# EAGLE schematic rx5808 vTup 0.4 (EAGLE 7.4.0)
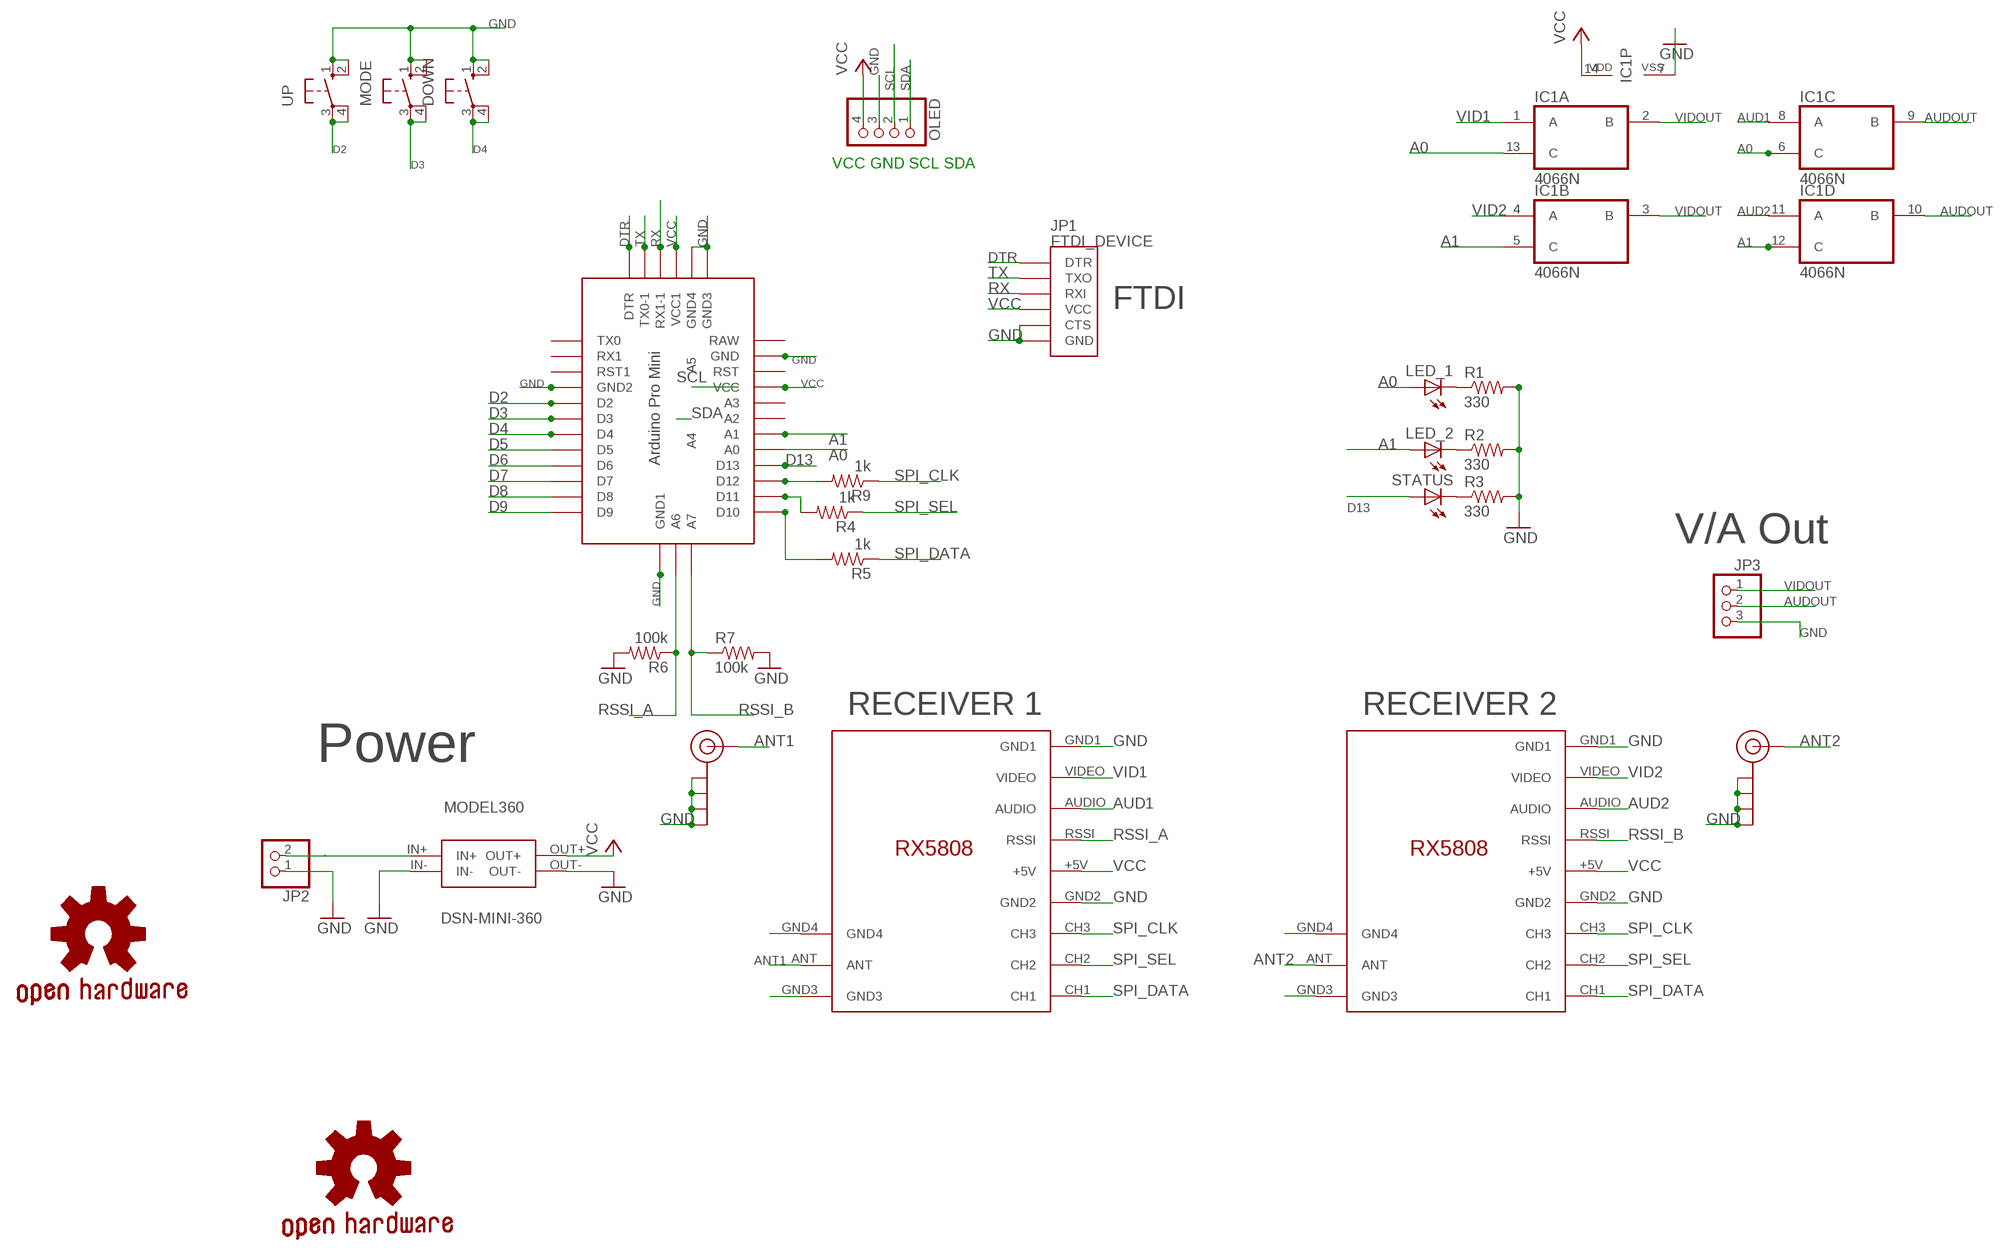
[diagram p0: schematic, sheet 1]

## Parts
ANT1  SMA_EDGE  [SMA-EDGE]
ANT2  SMA_EDGE  [SMA-EDGE]
DOWN  10-XX  [B3F-10XX]
DSN-MINI-360  MODEL360  [MODEL360]
GOLD_ORB_SM1  OSHWLOGO_GOLD_ORB_LG  [OSHW0]
GOLD_ORB_SM2  OSHWLOGO_GOLD_ORB_SM  [OSHW2]
IC1  4066N  [DIL14]
JP1  FTDI_DEVICE  [FTDI_DEVICE_SIDE]
JP2  PINHD-1X2  [1X02]
JP3  PINHD-1X3  [1X03]
LED_1  LED5MM  [LED5MM]
LED_2  LED5MM  [LED5MM]
MODE  10-XX  [B3F-10XX]
OLED  PINHD-1X4  [1X04]
R1  330  R-US_0207/7  [0207/7]
R2  330  R-US_0207/7  [0207/7]
R3  330  R-US_0207/7  [0207/7]
R4  1k  R-US_0207/7  [0207/7]
R5  1k  R-US_0207/7  [0207/7]
R6  100k  R-US_0207/7  [0207/7]
R7  100k  R-US_0207/7  [0207/7]
R9  1k  R-US_0207/7  [0207/7]
RECEIVER_A  RX5808_A  RX5808  [RX5808]
RECEIVER_B  RX5808_B  RX5808  [RX5808]
STATUS  LED5MM  [LED5MM]
U$1  Pro Mini  ABK-PRO-MINI  [ABK-PRO-MINI]
UP  10-XX  [B3F-10XX]

## Nets
A0: IC1.6(C:C) IC1.13(A:C) LED_1.A U$1.A0
A1: IC1.5(B:C) IC1.12(D:C) LED_2.A U$1.A1
ANT1: ANT1.SIG(SIGNAL) RECEIVER_A.ANT
ANT2: ANT2.SIG(SIGNAL) RECEIVER_B.ANT
AUD1: IC1.8(C:A) RECEIVER_A.AUDIO
AUD2: IC1.11(D:A) RECEIVER_B.AUDIO
AUDOUT: IC1.9(C:B) IC1.10(D:B) JP3.2
D2: U$1.D2 UP.3(P) UP.4(P1)
D3: MODE.3(P) MODE.4(P1) U$1.D3
D4: DOWN.3(P) DOWN.4(P1) U$1.D4
D10: R5.2 U$1.D10
D11: R4.2 U$1.D11
D12: R9.2 U$1.D12
D13: STATUS.A U$1.D13
DTR: JP1.P$1(DTR) U$1.GND2(DTR)
GND: ANT1.GND@0(GND) ANT1.GND@1(GND) ANT1.GND@2(GND) ANT1.GND@3(GND) ANT2.GND@0(GND) ANT2.GND@1(GND) ANT2.GND@2(GND) ANT2.GND@3(GND) DOWN.1(S) DOWN.2(S1) DSN-MINI-360.IN- DSN-MINI-360.OUT- IC1.7(P:VSS) JP1.P$5(CTS) JP1.P$6(GND) JP2.1 JP3.3 MODE.1(S) MODE.2(S1) OLED.3 R1.2 R2.2 R3.2 R6.2 R7.2 RECEIVER_A.GND1 RECEIVER_A.GND2 RECEIVER_A.GND3 RECEIVER_A.GND4 RECEIVER_B.GND1 RECEIVER_B.GND2 RECEIVER_B.GND3 RECEIVER_B.GND4 U$1.DTR(GND3) U$1.GND U$1.GND1(GND2) U$1.GND4(GND1) U$1.TX0-1(GND4) UP.1(S) UP.2(S1)
N$1: LED_1.K(C) R1.1
N$2: LED_2.K(C) R2.1
N$3: R3.1 STATUS.K(C)
N$5: DSN-MINI-360.IN+ JP2.2
RSSI_A: R6.1 RECEIVER_A.RSSI U$1.A6
RSSI_B: R7.1 RECEIVER_B.RSSI U$1.A7
RX: JP1.P$3(RXI) U$1.VCC1(RX1-1)
SCL: OLED.2 U$1.A5
SDA: OLED.1 U$1.A4
SPI_CLK: R9.1 RECEIVER_A.CH3 RECEIVER_B.CH3
SPI_DATA: R5.1 RECEIVER_A.CH1 RECEIVER_B.CH1
SPI_SEL: R4.1 RECEIVER_A.CH2 RECEIVER_B.CH2
TX: JP1.P$2(TXO) U$1.GND3(TX0-1)
VCC: DSN-MINI-360.OUT+ IC1.14(P:VDD) JP1.P$4(VCC) OLED.4 RECEIVER_A.+5V RECEIVER_B.+5V U$1.RX1-1(VCC1) U$1.VCC
VID1: IC1.1(A:A) RECEIVER_A.VIDEO
VID2: IC1.4(B:A) RECEIVER_B.VIDEO
VIDOUT: IC1.2(A:B) IC1.3(B:B) JP3.1
Unconnected: U$1.A2 U$1.A3 U$1.D5 U$1.D6 U$1.D7 U$1.D8 U$1.D9 U$1.RAW U$1.RST U$1.RST1 U$1.RX1 U$1.TX0

## Notes on the sheet
- VCC GND SCL SDA
- FTDI
- V/A Out
- RECEIVER 1 | RECEIVER 2
- Power

## Library data of the parts
ANT1 ANT2 = SparkFun-Connectors:SMA_EDGE: SMA Antenna Connector End launch SMA connector. The paste layer has been removed so that the connector can be hand soldered onto the board after reflow.
DOWN MODE UP = switch-omron:10-XX: OMRON SWITCH; MPN: B3F-1000; OC_FARNELL: 176432; OC_NEWARK: 36M3542
DSN-MINI-360 = Model-360-Step-Down:MODEL360
GOLD_ORB_SM1 GOLD_ORB_SM2 = open-source:OSHWLOGO: These are Open-Source Hardware logos.
IC1 = 40xx:4066: Quad bilateral ANALOG SWITCH
JP1 = SparkFun-Connectors:FTDI_DEVICE: Connector which mates to FTDI basic or FTDI cable.
JP2 = pinhead:PINHD-1X2: PIN HEADER
JP3 = pinhead:PINHD-1X3: PIN HEADER
LED_1 LED_2 STATUS = led:LED: LED OSRAM: - CHIPLED LG R971, LG N971, LY N971, LG Q971, LY Q971, LO R971, LY R971 LH N974, LH R974 LS Q976, LO Q976, LY Q976 LO Q996 - Hyper CHIPLED LW Q18S LB Q993, LB Q99A, LB R99A - SideLED LS A670, LO A670, LY A670, LG A670, LP A670 LB A673, LV A673, LT A673, LW A673 LH A674 LY A675 LS A676, LA A676, LO A676, LY A676, LW A676 LS A679, LY A679, LG A679 - Hyper Micro SIDELED® LS Y876, LA Y876, LO Y876, LY Y876 LT Y87S - SmartLED LW L88C, LW L88S LB L89C, LB L89S, LG L890 LS L89K, LO L89K, LY L89K LS L896, LA L896, LO L896, LY L896 - TOPLED LS T670, LO T670, LY T670, LG T670, LP T670 LSG T670, LSP T670, LSY T670, LOP T670, LYG T670 LG T671, LOG T671, LSG T671 LB T673, LV T673, LT T673, LW T673 LH T674 LS T676, LA T676, LO T676, LY T676, LB T676, LH T676, LSB T676, LW T676 LB T67C, LV T67C, LT T67C, LS T67K, LO T67K, LY T67K, LW E67C LS E67B, LA E67B, LO E67B, LY E67B, LB E67C, LV E67C, LT E67C LW T67C LS T679, LY T679, LG T679 LS T770, LO T770, LY T770, LG T770, LP T770 LB T773, LV T773, LT T773, LW T773 LH T774 LS E675, LA E675, LY E675, LS T675 LS T776, LA T776, LO T776, LY T776, LB T776 LHGB T686 LT T68C, LB T68C - Hyper Mini TOPLED® LB M676 - Mini TOPLED Santana® LG M470 LS M47K, LO M47K, LY M47K Source: http://www.osram.convergy.de LUXEON: - LUMILED® LXK2-PW12-R00, LXK2-PW12-S00, LXK2-PW14-U00, LXK2-PW14-V00 LXK2-PM12-R00, LXK2-PM12-S00, LXK2-PM14-U00 LXK2-PE12-Q00, LXK2-PE12-R00, LXK2-PE12-S00, LXK2-PE14-T00, LXK2-PE14-U00 LXK2-PB12-K00, LXK2-PB12-L00, LXK2-PB12-M00, LXK2-PB14-N00, LXK2-PB14-P00, LXK2-PB14-Q00 LXK2-PR12-L00, LXK2-PR12-M00, LXK2-PR14-Q00, LXK2-PR14-R00 LXK2-PD12-Q00, LXK2-PD12-R00, LXK2-PD12-S00 LXK2-PH12-R00, LXK2-PH12-S00 LXK2-PL12-P00, LXK2-PL12-Q00, LXK2-PL12-R00 Source: www.luxeon.com KINGBRIGHT: KA-3528ASYC Source: www.kingbright.com
OLED = pinhead:PINHD-1X4: PIN HEADER
R1-R7 R9 = rcl:R-US_: RESISTOR, American symbol
RECEIVER_A RECEIVER_B = 1customstuff:RX5808
U$1 = Arduino-clone:ABK-PRO-MINI: ABK Pro-Mini Arduino Clone